# EAGLE design OSO-MISC-20-025 Long Flex Cable for Ring (EAGLE 9.6.2)
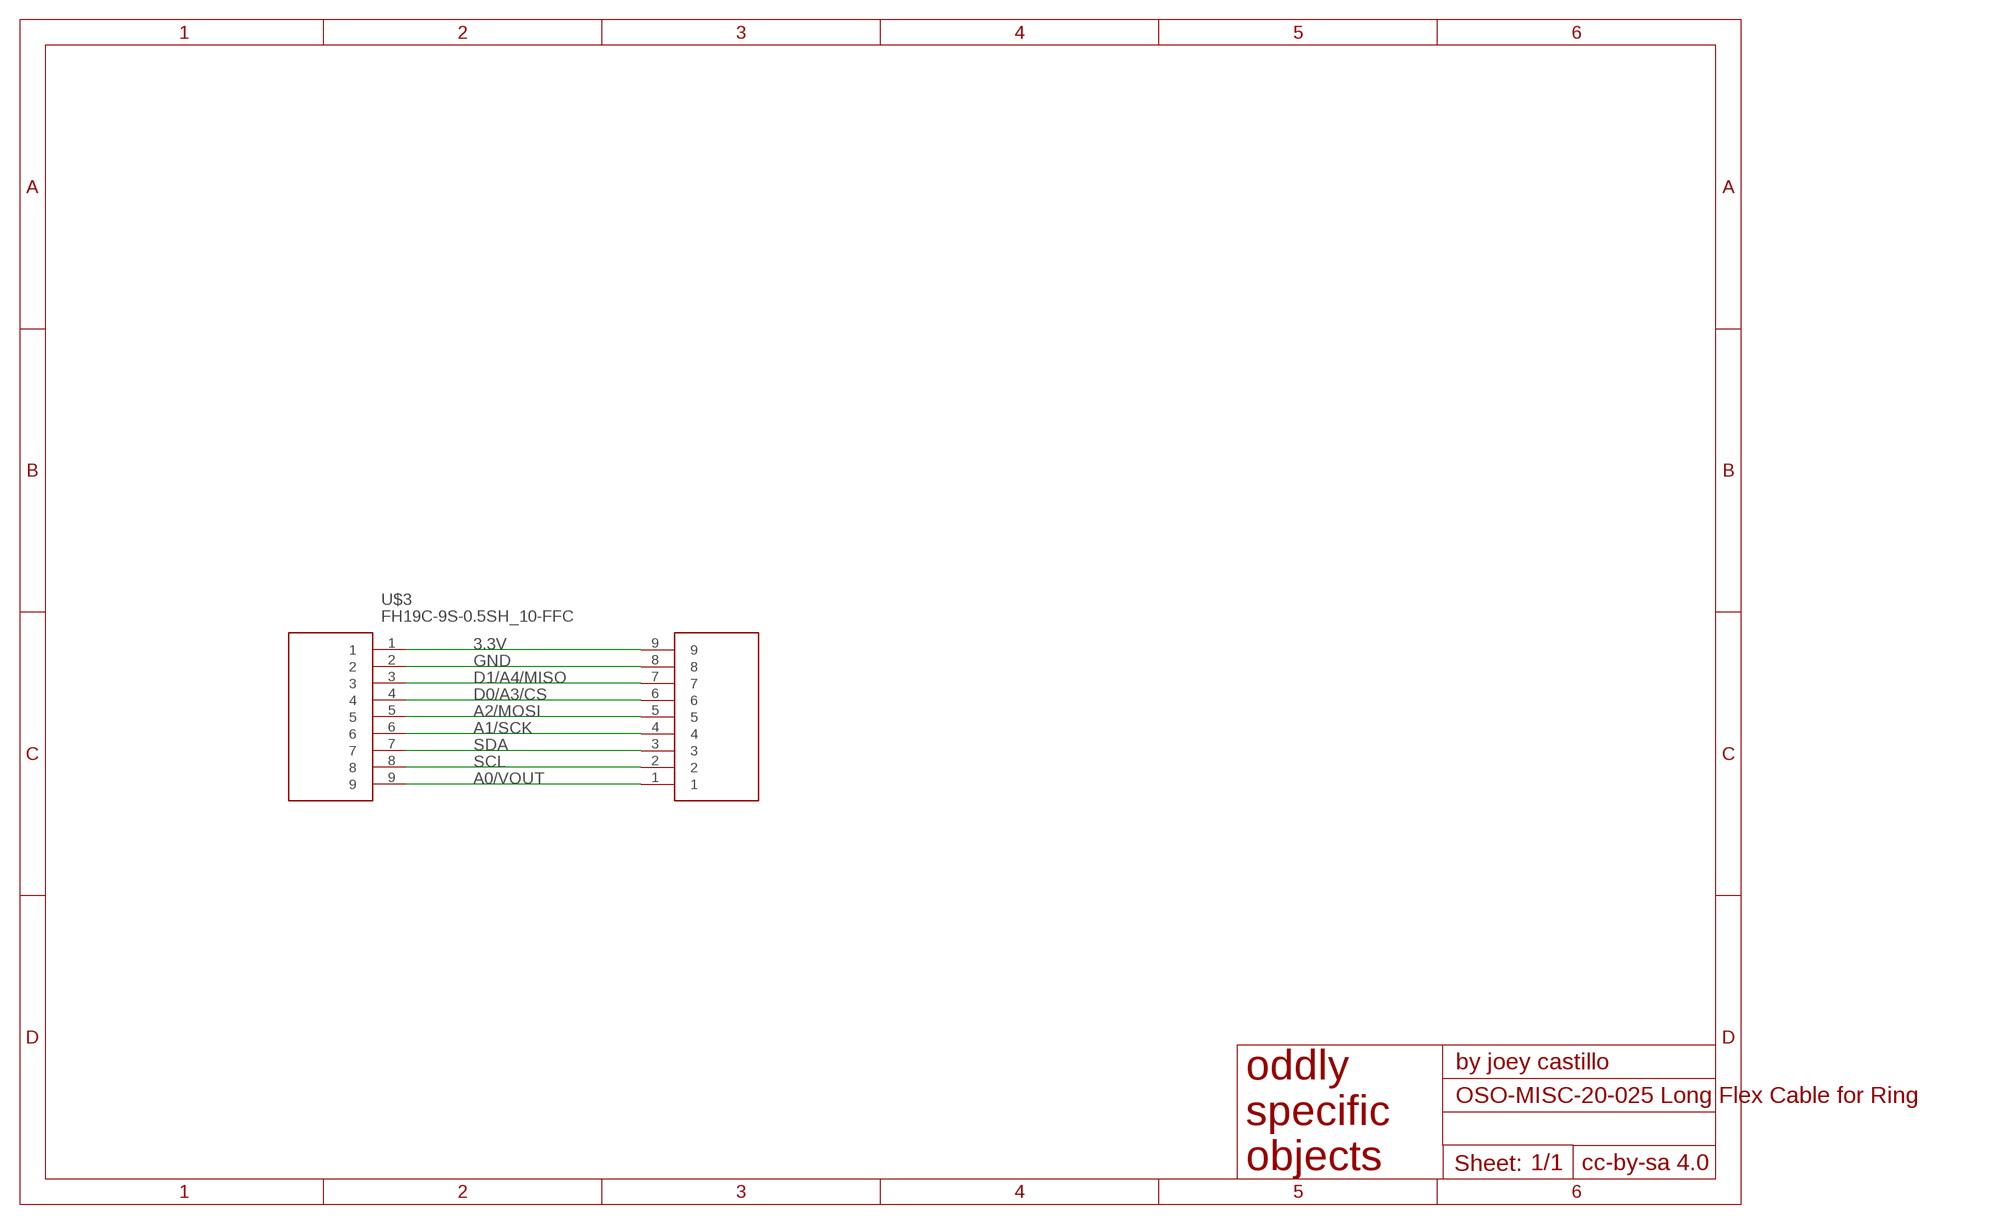
[diagram p0: schematic, sheet 1]

## Parts
U$1  FH19C-9S-0.5SH_10-FFC  [FH19C9S05SH10-FFC]
U$3  FH19C-9S-0.5SH_10-FFC  [FH19C9S05SH10-FFC]

## Nets
3.3V: U$1.9 U$3.1
A0/VOUT: U$1.1 U$3.9
A1/SCK: U$1.4 U$3.6
A2/MOSI: U$1.5 U$3.5
D0/A3/CS: U$1.6 U$3.4
D1/A4/MISO: U$1.7 U$3.3
GND: U$1.8 U$3.2
SCL: U$1.2 U$3.8
SDA: U$1.3 U$3.7

## Library data of the parts
U$1 U$3 = FH19C-9S-0.5SH:FH19C-9S-0.5SH_10-FFC

## Net classes
1 power: width 0.305 mm

## Board
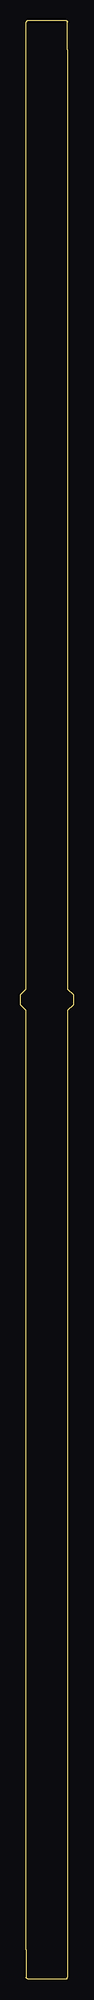
[diagram p1: board, top side]
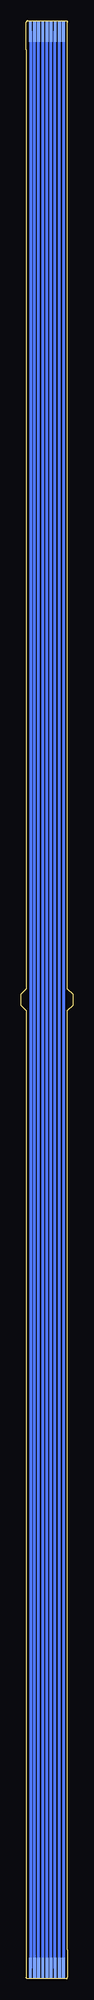
[diagram p2: board, bottom side, seen from below]

Size 6.35 x 235.6 mm. Coordinates in mm from the lower left corner, seen from the top.
Outline: 0.69,3.5 0.69,116.48 0,117.16 0,118.44 0.69,119.12 0.69,232.1
Outline: 5.66,232.1 5.66,119.12 6.35,118.44 6.35,117.16 5.66,116.48 5.66,3.5
Copper layers (1*16): Top 0.035559375mm / dielectric 4mil / Bottom 0.035559375mm
Design rules "oshpark-2layer *": minimum track width 6mil, minimum drill 10mil, track to track 6mil, track to pad 6mil, pad to pad 6mil, via to via 6mil, smd to smd 6mil, copper to edge 6mil, drill to drill 6mil, minimum pad ring 5mil, minimum via ring 5mil, stop-mask expansion 2.5mil, vias tented up to drill 12mil, thermal gap 10mil

### Footprints (pad centres in the part's own frame; a part is rotated, then mirrored left to right if it is on the bottom)
FH19C9S05SH10-FFC = smd 0.347 x 2.5 bottom: 1 2,-2.25; 2 1.5,-2.25; 3 1,-2.25; 4 0.5,-2.25; 5 0,-2.25; 6 -0.5,-2.25; 7 -1,-2.25; 8 -1.5,-2.25; 9 -2,-2.25

### Placement (x,y rotation side)
U$1  3.17,232.1 180 top
U$3  3.17,3.5 0 top

### Tracks (layer width: path | path; a pad name or v marks a point on that pad's centre or on a via)
3.3V
  Bottom 0.34: U$1.9 U$3.1
A0/VOUT
  Bottom 0.34: U$1.1 U$3.9
A1/SCK
  Bottom 0.34: U$3.6 U$1.4
A2/MOSI
  Bottom 0.34: U$3.5 U$1.5
D0/A3/CS
  Bottom 0.34: U$3.4 U$1.6
D1/A4/MISO
  Bottom 0.34: U$3.3 U$1.7
GND
  Bottom 0.34: U$3.2 U$1.8
SCL
  Bottom 0.34: U$3.8 U$1.2
SDA
  Bottom 0.34: U$3.7 U$1.3